# Altium schematic sheet NB3000_WAV_Player.SchDoc
size B; Organization: Altium Limited; Address1: L3, 12a Rodborough Rd; Address2: Frenchs Forest; Address3: NSW; Address4: Australia 2086; DocumentNumber: 1; SheetNumber: 1; SheetTotal: 2
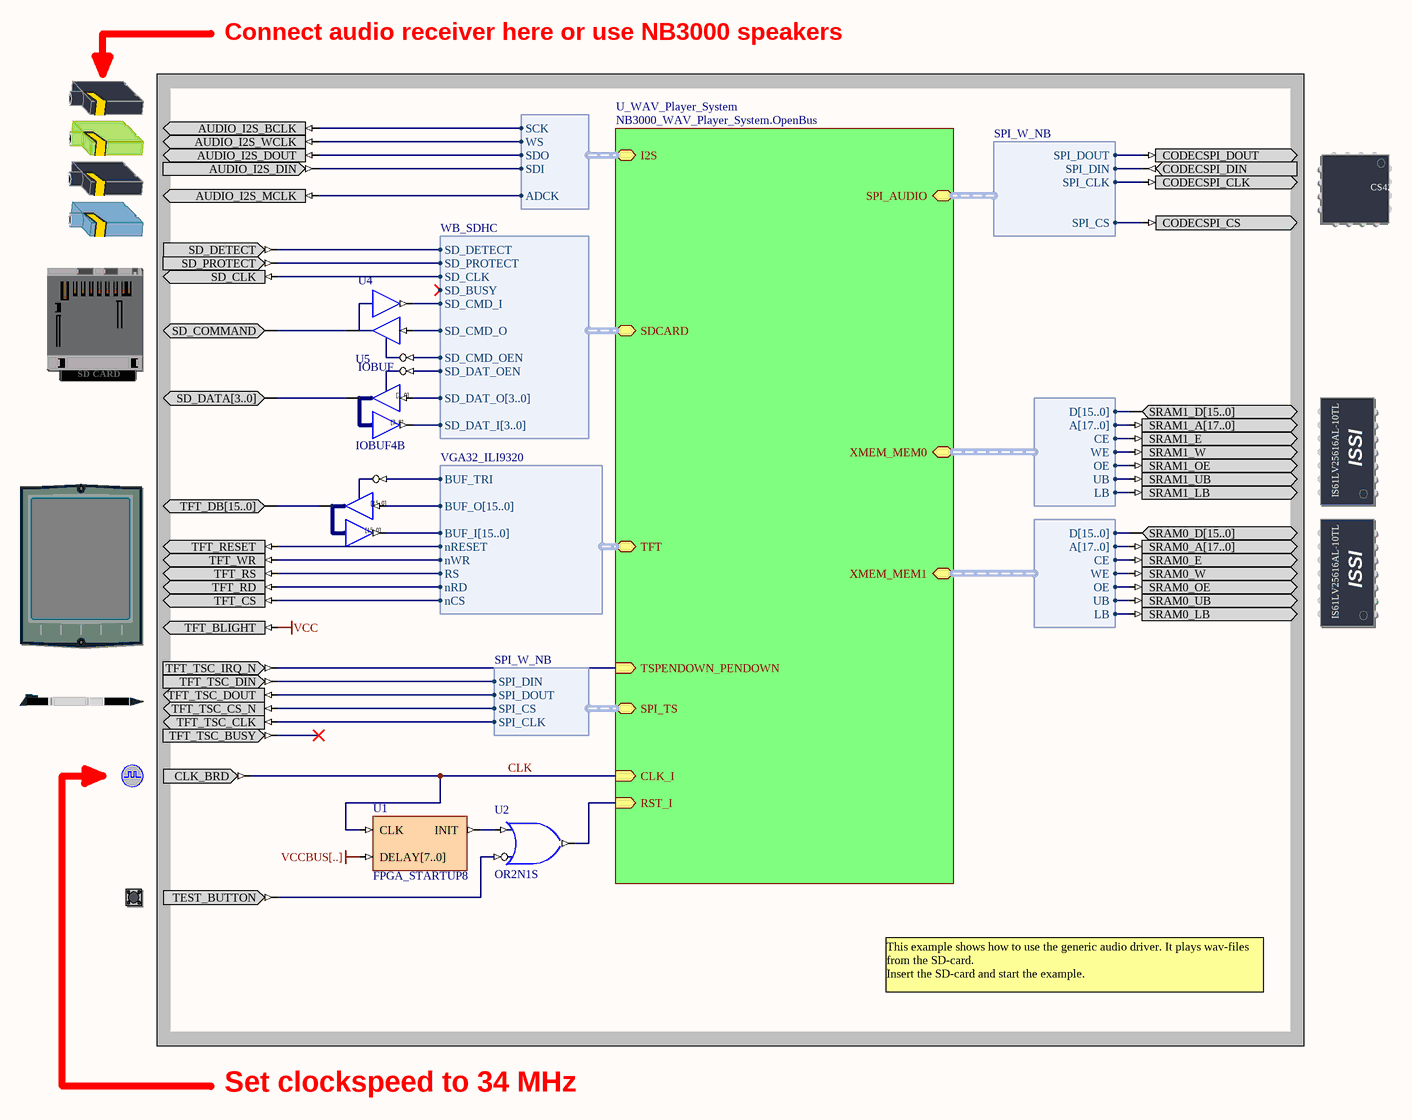
[diagram p0: NB3000_WAV_Player.SchDoc]

## Parts
(Parts that share a designator on the sheet are numbered #1, #2 ... from top to bottom, then left to right.)
?#1  AUDIO_CODEC  (value not drawn)
?#2  AUDIO_CODEC_CTRL  (value not drawn)
?#3  SD_HOST  (value not drawn)
?#4  SRAM1  (value not drawn)
?#5  TFT_LCD  (value not drawn)
?#6  SRAM0  (value not drawn)
?#7  TFT_PEN  (value not drawn)
?#8  CLOCK_BOARD  (value not drawn)
?#9  TEST_BUTTON  (value not drawn)
U1  FPGA_STARTUP8
U2  OR2N1S
U3  IOBUF16B  (value not drawn)
U4  IOBUF
U5  IOBUF4B

## Sub-sheets
U_WAV_Player_System = NB3000_WAV_Player_System.OpenBus: CLK_I (in), RST_I (in), I2S (harness I2S_W_Both), XMEM_MEM0 (harness WB_MEM_CTRL_SRAM16_A18), XMEM_MEM1 (harness WB_MEM_CTRL_SRAM16_A18), TSPENDOWN_PENDOWN (in), TFT (harness VGA32_ILI9320), SPI_AUDIO (harness SPI_W_NB), SDCARD (harness WB_SDHC), SPI_TS (harness SPI_W_NB)

## Harnesses
I2S_W_Both: SCK, WS, SDO, SDI, ADCK
WB_MEM_CTRL_SRAM16_A18: D[15..0], A[17..0], CE, WE, OE, UB, LB
VGA32_ILI9320: BUF_TRI, BUF_O[15..0], BUF_I[15..0], nRESET, nWR, RS, nRD, nCS
SPI_W_NB: SPI_DOUT, SPI_DIN, SPI_CLK, SPI_CS
WB_SDHC: SD_DETECT, SD_PROTECT, SD_CLK, SD_BUSY, SD_CMD_OEN, SD_CMD_O, SD_CMD_I, SD_DAT_OEN, SD_DAT_O[3..0], SD_DAT_I[3..0]

## Nets
VCC: ?#5.TFT_BLIGHT
VCCBUS[..]: U1.DELAY[7..0]
CLK: ?#8.CLK_BRD U1.CLK ; sheet U_WAV_Player_System/CLK_I
Net?#1_AUDIO_I2S_BCLK: ?#1.AUDIO_I2S_BCLK ; sheet U_WAV_Player_System/I2S.SCK
Net?#1_AUDIO_I2S_DIN: ?#1.AUDIO_I2S_DIN ; sheet U_WAV_Player_System/I2S.SDI
Net?#1_AUDIO_I2S_DOUT: ?#1.AUDIO_I2S_DOUT ; sheet U_WAV_Player_System/I2S.SDO
Net?#1_AUDIO_I2S_MCLK: ?#1.AUDIO_I2S_MCLK ; sheet U_WAV_Player_System/I2S.ADCK
Net?#1_AUDIO_I2S_WCLK: ?#1.AUDIO_I2S_WCLK ; sheet U_WAV_Player_System/I2S.WS
Net?#2_CODECSPI_CLK: ?#2.CODECSPI_CLK ; sheet U_WAV_Player_System/SPI_AUDIO.SPI_CLK
Net?#2_CODECSPI_CS: ?#2.CODECSPI_CS ; sheet U_WAV_Player_System/SPI_AUDIO.SPI_CS
Net?#2_CODECSPI_DIN: ?#2.CODECSPI_DIN ; sheet U_WAV_Player_System/SPI_AUDIO.SPI_DIN
Net?#2_CODECSPI_DOUT: ?#2.CODECSPI_DOUT ; sheet U_WAV_Player_System/SPI_AUDIO.SPI_DOUT
Net?#3_SD_CLK: ?#3.SD_CLK ; sheet U_WAV_Player_System/SDCARD.SD_CLK
Net?#3_SD_COMMAND: ?#3.SD_COMMAND U4.IO
Net?#3_SD_DATA[3..0]: ?#3.SD_DATA[3..0] U5.IO[3..0]
Net?#3_SD_DETECT: ?#3.SD_DETECT ; sheet U_WAV_Player_System/SDCARD.SD_DETECT
Net?#3_SD_PROTECT: ?#3.SD_PROTECT ; sheet U_WAV_Player_System/SDCARD.SD_PROTECT
Net?#4_SRAM1_A[17..0]: ?#4.SRAM1_A[17..0] ; sheet U_WAV_Player_System/XMEM_MEM0.A[17..0]
Net?#4_SRAM1_D[15..0]: ?#4.SRAM1_D[15..0] ; sheet U_WAV_Player_System/XMEM_MEM0.D[15..0]
Net?#4_SRAM1_E: ?#4.SRAM1_E ; sheet U_WAV_Player_System/XMEM_MEM0.CE
Net?#4_SRAM1_LB: ?#4.SRAM1_LB ; sheet U_WAV_Player_System/XMEM_MEM0.LB
Net?#4_SRAM1_OE: ?#4.SRAM1_OE ; sheet U_WAV_Player_System/XMEM_MEM0.OE
Net?#4_SRAM1_UB: ?#4.SRAM1_UB ; sheet U_WAV_Player_System/XMEM_MEM0.UB
Net?#4_SRAM1_W: ?#4.SRAM1_W ; sheet U_WAV_Player_System/XMEM_MEM0.WE
Net?#5_TFT_CS: ?#5.TFT_CS ; sheet U_WAV_Player_System/TFT.nCS
Net?#5_TFT_DB[15..0]: ?#5.TFT_DB[15..0] U3.IO[15..0]
Net?#5_TFT_RD: ?#5.TFT_RD ; sheet U_WAV_Player_System/TFT.nRD
Net?#5_TFT_RESET: ?#5.TFT_RESET ; sheet U_WAV_Player_System/TFT.nRESET
Net?#5_TFT_RS: ?#5.TFT_RS ; sheet U_WAV_Player_System/TFT.RS
Net?#5_TFT_WR: ?#5.TFT_WR ; sheet U_WAV_Player_System/TFT.nWR
Net?#6_SRAM0_A[17..0]: ?#6.SRAM0_A[17..0] ; sheet U_WAV_Player_System/XMEM_MEM1.A[17..0]
Net?#6_SRAM0_D[15..0]: ?#6.SRAM0_D[15..0] ; sheet U_WAV_Player_System/XMEM_MEM1.D[15..0]
Net?#6_SRAM0_E: ?#6.SRAM0_E ; sheet U_WAV_Player_System/XMEM_MEM1.CE
Net?#6_SRAM0_LB: ?#6.SRAM0_LB ; sheet U_WAV_Player_System/XMEM_MEM1.LB
Net?#6_SRAM0_OE: ?#6.SRAM0_OE ; sheet U_WAV_Player_System/XMEM_MEM1.OE
Net?#6_SRAM0_UB: ?#6.SRAM0_UB ; sheet U_WAV_Player_System/XMEM_MEM1.UB
Net?#6_SRAM0_W: ?#6.SRAM0_W ; sheet U_WAV_Player_System/XMEM_MEM1.WE
Net?#7_TFT_TSC_CLK: ?#7.TFT_TSC_CLK ; sheet U_WAV_Player_System/SPI_TS.SPI_CLK
Net?#7_TFT_TSC_CS_N: ?#7.TFT_TSC_CS_N ; sheet U_WAV_Player_System/SPI_TS.SPI_CS
Net?#7_TFT_TSC_DIN: ?#7.TFT_TSC_DIN ; sheet U_WAV_Player_System/SPI_TS.SPI_DIN
Net?#7_TFT_TSC_DOUT: ?#7.TFT_TSC_DOUT ; sheet U_WAV_Player_System/SPI_TS.SPI_DOUT
Net?#7_TFT_TSC_IRQ_N: ?#7.TFT_TSC_IRQ_N ; sheet U_WAV_Player_System/TSPENDOWN_PENDOWN
Net?#9_TEST_BUTTON: ?#9.TEST_BUTTON U2.I0
NetU1_INIT: U1.INIT U2.I1
NetU2_O: U2.O ; sheet U_WAV_Player_System/RST_I
NetU3_I[15..0]: U3.I[15..0] ; sheet U_WAV_Player_System/TFT.BUF_O[15..0]
NetU3_O[15..0]: U3.O[15..0] ; sheet U_WAV_Player_System/TFT.BUF_I[15..0]
NetU3_T: U3.T ; sheet U_WAV_Player_System/TFT.BUF_TRI
NetU4_I: U4.I ; sheet U_WAV_Player_System/SDCARD.SD_CMD_O
NetU4_O: U4.O ; sheet U_WAV_Player_System/SDCARD.SD_CMD_I
NetU4_T: U4.T ; sheet U_WAV_Player_System/SDCARD.SD_CMD_OEN
NetU5_I[3..0]: U5.I[3..0] ; sheet U_WAV_Player_System/SDCARD.SD_DAT_O[3..0]
NetU5_O[3..0]: U5.O[3..0] ; sheet U_WAV_Player_System/SDCARD.SD_DAT_I[3..0]
NetU5_T: U5.T ; sheet U_WAV_Player_System/SDCARD.SD_DAT_OEN

Not connected (* = marked no-connect by the designer): ?#7 TFT_TSC_BUSY*

## Notes on the sheet
- Connect audio receiver here or use NB3000 speakers
- This example shows how to use the generic audio driver. It plays wav-files from the SD-card.
  Insert the SD-card and start the example.
- Set clockspeed to 34 MHz
- Title
- Size:
- Date:
- B
- Number:
- Time:
- Revision:
- Sheet
- of
- File:
- (in symbol AUDIO_CODEC_CTRL) CS4270
- (in symbol IOBUF4B) [3..0]
- (in symbol IOBUF16B) [15..0]
- (in symbol SD_HOST) SD CARD
- (in symbol SRAM0) ISSI; IS61LV25616AL-10TL
- (in symbol SRAM1) ISSI; IS61LV25616AL-10TL

## Library data of the parts
?#1 = AUDIO_CODEC: Audio Codec; PortComponent: True; IncludeInDSF: AUDIO_CS4270; Published: 22-Jan-2007; Publisher: Altium Limited; HelpURL: https://wiki.altium.com/display/ADOH/NanoBoard+3000+-+Audio+CODEC
?#2 = AUDIO_CODEC_CTRL: Audio Codec Control; PortComponent: True; Published: 22-Jan-2007; Publisher: Altium Limited; HelpURL: https://wiki.altium.com/display/ADOH/NanoBoard+3000+-+Audio+CODEC
?#3 = SD_HOST: Secure Digital Card Host; PortComponent: True; Published: 30-Nov-2009; Publisher: Altium Limited; UseInDSF: True
?#4 = SRAM1: Free Static RAM - Daughterboard; PortComponent: True; Published: 14-May-2007; Publisher: Altium Limited; HelpURL: https://wiki.altium.com/display/ADOH/NanoBoard+3000+-+Independent+SRAM
?#5 = TFT_LCD: TFT LCD Panel; PortComponent: True; Published: 22-Jan-2007; Publisher: Altium Limited; HelpURL: https://wiki.altium.com/display/ADOH/NanoBoard+3000+-+TFT+LCD+Panel+%28with+Touch+Screen%29
?#6 = SRAM0: Free Static RAM - Daughterboard; PortComponent: True; Published: 14-May-2007; Publisher: Altium Limited; HelpURL: https://wiki.altium.com/display/ADOH/NanoBoard+3000+-+Independent+SRAM
?#7 = TFT_PEN: Touch Screen Pen Control; PortComponent: True; Published: 22-Jan-2007; Publisher: Altium Limited; HelpURL: https://wiki.altium.com/display/ADOH/NanoBoard+3000+-+TFT+LCD+Panel+%28with+Touch+Screen%29
?#8 = CLOCK_BOARD: Global System Clock Supply; PortComponent: True; Published: 19-Nov-2003; Publisher: Altium Limited; HelpURL: TR0143 Technical Reference Manual for Altium's Desktop NanoBoard NB2DSK01.pdf#page=41; UseInDSF: True
?#9 = TEST_BUTTON: Test / Reset Button; PortComponent: True; Published: 19-Nov-2003; Publisher: Altium Limited; HelpURL: TR0143 Technical Reference Manual for Altium's Desktop NanoBoard NB2DSK01.pdf#page=53
U1 = FPGA_STARTUP8: FPGA Startup With 8 Bit Delay; Published: 9-Dec-2004; Publisher: Altium Limited; HelpURL: CR0119 FPGA_STARTUPx Powerup Delay Unit.pdf; LastRevisionNo: 1.00.00; ComponentLink1Description: Core &Resource Usage; ComponentLink1URL: CR0139 FPGA Peripheral Resource Usage.pdf#page=11
U2 = OR2N1S: 2-Input OR Gate with Active Low A Input, Single Pin Version; XilinxEquivalent: OR2B1; FunctionalClass: Logic Primitive; PortSize: 2; ArchiveName: GENERIC; VHDLIB_SIM: GENERIC_LIB; Published: 29-Jan-2004; Publisher: Altium Limited; LastRevisionNo: 1.00.00; HelpURL: CR0118 FPGA Generic Library Guide.pdf#page=410; ComponentLink1URL: CR0136 FPGA Logic Primitive Resource Usage.pdf#page=187; ComponentLink1Description: Core &Resource Usage; SubClass: OR; PortStyle: Single Pin Version
U3 = IOBUF16B: 16-Bit Input/Output Buffer, Bus Version; SubClass: IOBUF; Enable: Low; Control: Common Control T; PortSize: 16; ArchiveName: GENERIC; VHDLIB_SIM: GENERIC_LIB; Published: 29-Jan-2004; Publisher: Altium Limited; LastRevisionNo: 1.00.00; HelpURL: CR0118 FPGA Generic Library Guide.pdf#page=293; ComponentLink1URL: CR0125 FPGA Buffer Resource Usage.pdf#page=91; ComponentLink1Description: Core &Resource Usage; FunctionalClass: Buffer; PortStyle: Bus Version
U4 = IOBUF: Input/Output Buffer; Enable: Low; Control: Common Control T; ArchiveName: GENERIC; VHDLIB_SIM: GENERIC_LIB; Published: 29-Jan-2004; Publisher: Altium Limited; XilinxEquivalent: IOBUF; LastRevisionNo: 1.00.00; HelpURL: CR0118 FPGA Generic Library Guide.pdf#page=293; ComponentLink1URL: CR0125 FPGA Buffer Resource Usage.pdf#page=78; ComponentLink1Description: Core &Resource Usage; FunctionalClass: Buffer; SubClass: IOBUF
U5 = IOBUF4B: 4-Bit Input/Output Buffer, Bus Version; SubClass: IOBUF; Enable: Low; Control: Common Control T; PortSize: 4; ArchiveName: GENERIC; VHDLIB_SIM: GENERIC_LIB; Published: 29-Jan-2004; Publisher: Altium Limited; LastRevisionNo: 1.00.00; HelpURL: CR0118 FPGA Generic Library Guide.pdf#page=293; ComponentLink1URL: CR0125 FPGA Buffer Resource Usage.pdf#page=82; ComponentLink1Description: Core &Resource Usage; FunctionalClass: Buffer; PortStyle: Bus Version